# Altium schematic sheet CATS-EUROC-Radio.SchDoc: CATS EuRoC Edition
size A4; Author: Luca Jost; Revision: V1.0; SheetNumber: 14; SheetTotal: 16; Subtitle: Radio
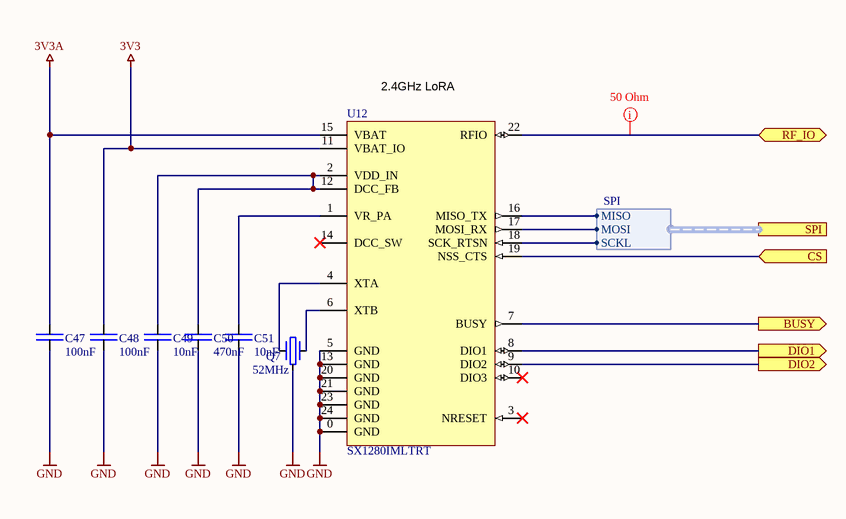
[diagram p0: CATS-EUROC-Radio.SchDoc]

## Parts
C47  100nF  [SMD Keramikkondensator 0402]
C48  100nF  [SMD Keramikkondensator 0402]
C49  10nF  [SMD Keramikkondensator 0402]
C50  470nF  [SMD Keramikkondensator 0402]
C51  10nF  [SMD Keramikkondensator 0402]
Q7  52MHz  [SMD Crystal 1.2X1.0X0.35]
U12  SX1280IMLTRT  [SMD IC QFN-24]

## Ports
BUSY (out), CS (in), DIO1 (out), DIO2 (out), RF_IO (bidir), SPI (harness SPI)

## Harnesses
SPI: SCKL, MOSI, MISO

## Nets
3V3: C48.2 U12.11(VBAT_IO)
3V3A: C47.2 U12.15(VBAT)
GND: C47.1 C48.1 C49.1 C50.1 C51.1 Q7.3 U12.0(GND) U12.5(GND) U12.13(GND) U12.20(GND) U12.21(GND) U12.23(GND) U12.24(GND)
BUSY: U12.7(BUSY) ; port BUSY
CS: U12.19(NSS_CTS) ; port CS
DIO1: U12.8(DIO1) ; port DIO1
DIO2: U12.9(DIO2) ; port DIO2
RF_IO: U12.22(RFIO) ; port RF_IO
NetC49_2: C49.2 C50.2 U12.2(VDD_IN) U12.12(DCC_FB)
NetC51_2: C51.2 U12.1(VR_PA)
NetQ7_1: Q7.1 U12.4(XTA)
NetQ7_2: Q7.2 U12.6(XTB)
NetU12_16: U12.16(MISO_TX) ; port SPI.MISO
NetU12_17: U12.17(MOSI_RX) ; port SPI.MOSI
NetU12_18: U12.18(SCK_RTSN) ; port SPI.SCKL

Not connected (* = marked no-connect by the designer): U12 3(NRESET)* 10(DIO3)* 14(DCC_SW)*

## Layout directives
rule Impedance Constraint [Min = 50.00    Max = 50.00    ]; net class RF-Line 50: RF_IO

## Notes on the sheet
- (near U12) 2.4GHz LoRA
- Title
- Author:
- Subtitle
- Date:
- Rev:
- File:
- Sheet
- of

## Library data of the parts
C47 C48 = E6 - 100nF: SMD Ceramic Capacitor E6; Unit Price: 0.01; Number: -; Supplier: -; JLC: C307331
C49 C51 = E6 - 10nF: SMD Ceramic Capacitor E6; Unit Price: 0.01; Number: -; Supplier: -; JLC: C15195
C50 = E6 - 470nF: SMD Ceramic Capacitor E6; Unit Price: 0.01; Number: -; Supplier: -; JLC: C47339
Q7 = Crystal 52MHz - R1210: 52 MHz ±7ppm Crystal 5pF 100 Ohms 4-SMD, No Lead; ComponentLink1Description: Datasheet; ComponentLink1URL: https://www.diodes.com/assets/Datasheets/FL.pdf; Digikey: 2151-R1210-52.000-5-F-0710-TR-ND
U12 = SX1280IMLTRT: Long Range, Low Power, 2.4 GHz / Transceiver with Ranging Capability; ComponentLink1Description: Datasheet; ComponentLink1URL: https://media.digikey.com/pdf/Data%20Sheets/Semtech%20PDFs/SX1280-81_Rev3.2_Mar2020.pdf; Digikey: SX1280IMLTRTCT-ND